# EAGLE design micromouse_v35 (EAGLE 8.0.1)
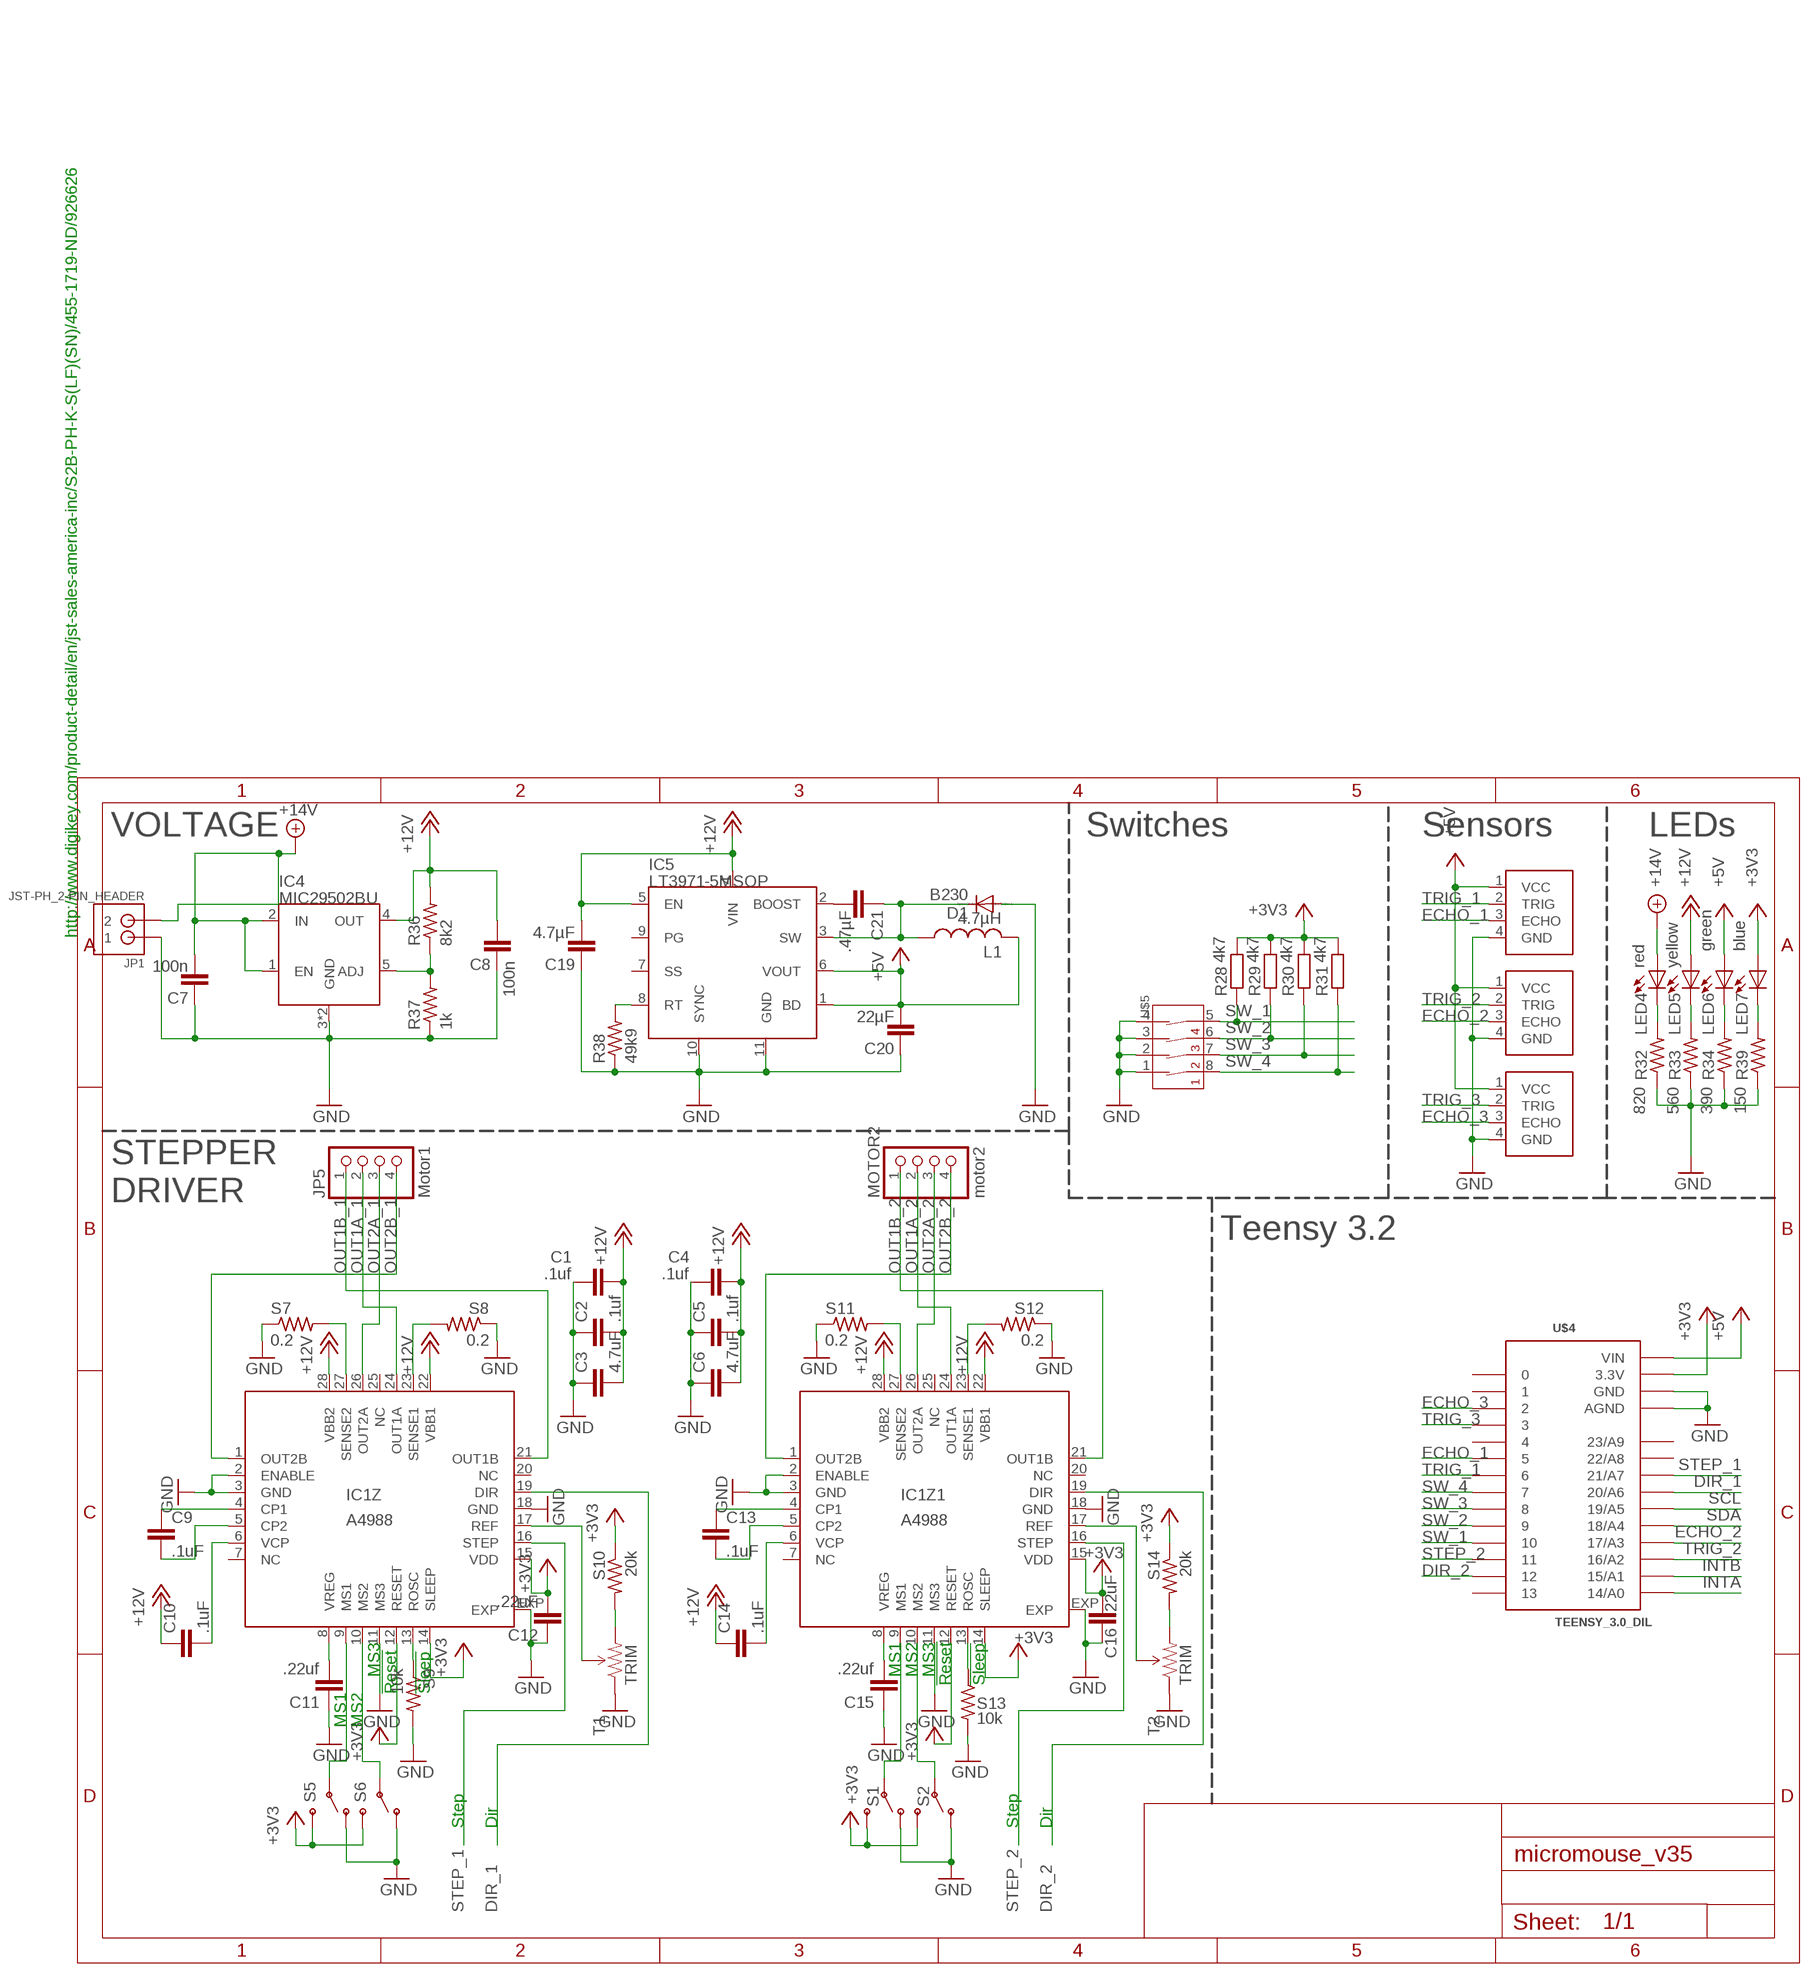
[diagram p0: schematic, sheet 1]

## Parts
C1  .1uf  C-EUC0603  [C0603]
C2  .1uf  C-EUC0603  [C0603]
C3  4.7uF  CAP1206  [1206]
C4  .1uf  C-EUC0603  [C0603]
C5  .1uf  C-EUC0603  [C0603]
C6  4.7uF  CAP1206  [1206]
C7  100n  C-EUC0603  [C0603]
C8  100n  C-EUC0603  [C0603]
C9  .1uF  C-EUC0603  [C0603]
C10  .1uF  C-EUC0603  [C0603]
C11  .22uf  C-EUC0603  [C0603]
C12  .22uF  C-EUC0603  [C0603]
C13  .1uF  C-EUC0603  [C0603]
C14  .1uF  C-EUC0603  [C0603]
C15  .22uf  C-EUC0603  [C0603]
C16  .22uF  C-EUC0603  [C0603]
C19  4.7µF  C-EUC0603  [C0603]
C20  22µF  C-EUC0805  [C0805]
C21  .47µF  C-EUC0603  [C0603]
D1  B230  DIODE-DO-214AC  [DO-214AC]
IC1Z  A4988  A4983  [QFN28ET]
IC1Z1  A4988  A4983  [QFN28ET]
IC4  MIC29502BU  [TO-263-5]
IC5  LT3971-5MSOP  [MSOP-10]
JP1  JST-PH_2-PIN_HEADER  [JST_B2B-PH_HEADER]
JP5  Motor1  PINHD-1X4  [1X04]
L1  4.7µH  L-USL1812  [L1812]
LED4  red  LEDSML0603  [SML0603]
LED5  yellow  LEDSML0603  [SML0603]
LED6  green  LEDSML0603  [SML0603]
LED7  blue  LEDSML0603  [SML0603]
MOTOR2  motor2  PINHD-1X4  [1X04]
R28  4k7  R-EU_R0603  [R0603]
R29  4k7  R-EU_R0603  [R0603]
R30  4k7  R-EU_R0603  [R0603]
R31  4k7  R-EU_R0603  [R0603]
R32  820  R-US_R0603  [R0603]
R33  560  R-US_R0603  [R0603]
R34  390  R-US_R0603  [R0603]
R36  8k2  R-US_R0603  [R0603]
R37  1k  R-US_R0603  [R0603]
R38  49k9  R-US_R0603  [R0603]
R39  150  R-US_R0603  [R0603]
S1  SWITCH-SPDT-SMD-A  [SWITCH-SPST-SMD-A]
S2  SWITCH-SPDT-SMD-A  [SWITCH-SPST-SMD-A]
S5  SWITCH-SPDT-SMD-A  [SWITCH-SPST-SMD-A]
S6  SWITCH-SPDT-SMD-A  [SWITCH-SPST-SMD-A]
S7  0.2  R-US_R0603  [R0603]
S8  0.2  R-US_R0603  [R0603]
S9  10k  R-US_R0603  [R0603]
S10  20k  R-US_R0603  [R0603]
S11  0.2  R-US_R0603  [R0603]
S12  0.2  R-US_R0603  [R0603]
S13  10k  R-US_R0603  [R0603]
S14  20k  R-US_R0603  [R0603]
SENSOR1  HC-SR04SMD  [HC-SR04_SMD]
SENSOR2  HC-SR04SMD  [HC-SR04_SMD]
SENSOR3  HC-SR04SMD  [HC-SR04_SMD]
T1  TRIM  TRIMPOTSMD  [TRIMPOT-3MM]
T2  TRIM  TRIMPOTSMD  [TRIMPOT-3MM]
U$4  TEENSY_3.0_DIL  [TEENSY3-DIL]
U$5  4-POS-DIP  [4-POS-DIP-SMD]

## Nets
+3V3: C12.2 C16.2 IC1Z1.12(RESET) IC1Z1.14(SLEEP) IC1Z1.15(VDD) IC1Z.12(RESET) IC1Z.14(SLEEP) IC1Z.15(VDD) LED7.A R28.2 R29.2 R30.2 R31.2 S1.3(S) S2.3(S) S5.3(S) S6.3(S) S10.1 S14.1 U$4.3.3V
+5V: C20.2 IC5.1(BD) IC5.6(VOUT) L1.2 LED6.A SENSOR1.1(VCC) SENSOR2.1(VCC) SENSOR3.1(VCC) U$4.VIN
+12V: C1.2 C2.2 C3.2 C4.2 C5.2 C6.2 C8.2 C10.1 C14.1 C19.2 IC1Z1.22(VBB1) IC1Z1.28(VBB2) IC1Z.22(VBB1) IC1Z.28(VBB2) IC4.4(OUT) IC5.4(VIN) IC5.5(EN) LED5.A R36.2
+14V: C7.2 IC4.1(EN) IC4.2(IN) JP1.P2 LED4.A
DIR_1: IC1Z.19(DIR) U$4.20/A6
DIR_2: IC1Z1.19(DIR) U$4.12
ECHO_1: SENSOR1.3(ECHO) U$4.5
ECHO_2: SENSOR2.3(ECHO) U$4.17/A3
ECHO_3: SENSOR3.3(ECHO) U$4.2
GND: C1.1 C2.1 C3.1 C4.1 C5.1 C6.1 C7.1 C8.1 C11.1 C12.1 C15.1 C16.1 C19.1 C20.1 D1.A IC1Z1.2(ENABLE) IC1Z1.3(GND) IC1Z1.11(MS3) IC1Z1.18(GND) IC1Z1.EXP IC1Z.2(ENABLE) IC1Z.3(GND) IC1Z.11(MS3) IC1Z.18(GND) IC1Z.EXP IC4.3(GND) IC4.6(GND) IC5.10(SYNC) IC5.11(GND) JP1.P1 R32.1 R33.1 R34.1 R37.1 R38.1 R39.1 S1.1(O) S2.1(O) S5.1(O) S6.1(O) S7.1 S8.1 S9.2 S11.1 S12.1 S13.2 SENSOR1.4(GND) SENSOR2.4(GND) SENSOR3.4(GND) T1.1(CCW) T2.1(CCW) U$4.AGND U$4.GND U$5.1(1A) U$5.2(2A) U$5.3(3A) U$5.4(4A)
INTA: U$4.14/A0
INTB: U$4.15/A1
N$15: LED4.C R32.2
N$16: LED5.C R33.2
N$17: LED6.C R34.2
N$18: IC4.5(ADJ) R36.1 R37.2
N$20: IC5.8(RT) R38.2
N$21: C21.2 IC5.2(BOOST)
N$22: C21.1 D1.C IC5.3(SW) L1.1
N$23: LED7.C R39.2
OUT1A_1: IC1Z.24(OUT1A) JP5.2
OUT1A_2: IC1Z1.24(OUT1A) MOTOR2.2
OUT1B_1: IC1Z.21(OUT1B) JP5.1
OUT1B_2: IC1Z1.21(OUT1B) MOTOR2.1
OUT2A_1: IC1Z.26(OUT2A) JP5.3
OUT2A_2: IC1Z1.26(OUT2A) MOTOR2.3
OUT2B_1: IC1Z.1(OUT2B) JP5.4
OUT2B_2: IC1Z1.1(OUT2B) MOTOR2.4
SCL: U$4.19/A5
SDA: U$4.18/A4
STEP_1: IC1Z.16(STEP) U$4.21/A7
STEP_2: IC1Z1.16(STEP) U$4.11
SW_1: R28.1 U$4.10 U$5.5(4B)
SW_2: R29.1 U$4.9 U$5.6(3B)
SW_3: R30.1 U$4.8 U$5.7(2B)
SW_4: R31.1 U$4.7 U$5.8(1B)
TRIG_1: SENSOR1.2(TRIG) U$4.6
TRIG_2: SENSOR2.2(TRIG) U$4.16/A2
TRIG_3: SENSOR3.2(TRIG) U$4.3
ZCP1: C9.1 IC1Z.4(CP1)
ZCP2: C9.2 IC1Z.5(CP2)
ZCP3: C13.1 IC1Z1.4(CP1)
ZCP4: C13.2 IC1Z1.5(CP2)
ZMS1: IC1Z.9(MS1) S5.2(P)
ZMS2: IC1Z.10(MS2) S6.2(P)
ZMS3: IC1Z1.9(MS1) S1.2(P)
ZMS4: IC1Z1.10(MS2) S2.2(P)
ZREF: IC1Z.17(REF) T1.2(WIPER)
ZREF1: IC1Z1.17(REF) T2.2(WIPER)
ZREF2: S10.2 T1.3(CW)
ZREF3: S14.2 T2.3(CW)
ZROSC: IC1Z.13(ROSC) S9.1
ZROSC1: IC1Z1.13(ROSC) S13.1
ZSENSE1: IC1Z.23(SENSE1) S8.2
ZSENSE2: IC1Z.27(SENSE2) S7.2
ZSENSE3: IC1Z1.27(SENSE2) S11.2
ZSENSE4: IC1Z1.23(SENSE1) S12.2
ZVCP: C10.2 IC1Z.6(VCP)
ZVCP1: C14.2 IC1Z1.6(VCP)
ZVREG: C11.2 IC1Z.8(VREG)
ZVREG1: C15.2 IC1Z1.8(VREG)
Unconnected: IC1Z1.7(NC) IC1Z1.20(NC) IC1Z1.25(NC) IC1Z.7(NC) IC1Z.20(NC) IC1Z.25(NC) IC5.7(SS) IC5.9(PG) U$4.0 U$4.1 U$4.4 U$4.13 U$4.22/A8 U$4.23/A9

## Notes on the sheet
- VOLTAGE | Switches | Sensors | LEDs
- PFD intermediate voltage
- Set for 'mixed-decay' mode.
- http://www.digikey.com/product-detail/en/jst-sales-america-inc/S2B-PH-K-S(LF)(SN)/455-1719-ND/926626 | TP1 = Vref input to driver | TP1 = Vref input to driver
- Monitor this test point with meter | Monitor this test point with meter
- as you adjust current adj pot | as you adjust current adj pot
- Valid range 1.0V to Vcc | Valid range 1.0V to Vcc
- At Vref of 5V max current will be 833mA | At Vref of 5V max current will be 833mA
- At Vref of 2V max current will be 333mA | At Vref of 2V max current will be 333mA
- At Vref of 1V max current will be 166mA | At Vref of 1V max current will be 166mA
- PFD intermediate voltage
- Minimum current gives smoothest microsteps | Minimum current gives smoothest microsteps
- Set for 'mixed-decay' mode.
- Maximum current gives highest torque | Maximum current gives highest torque
- Max Coil Current(in Amps) = Vref(in Volts)/6 | Max Coil Current(in Amps) = Vref(in Volts)/6
- Set R16 to 2.0V at factory = 333mA/phase | Set R16 to 2.0V at factory = 333mA/phase
- DEFAULT OPTIONS | DEFAULT OPTIONS
- Short JP5, JP6, JP7 pins | Short JP5, JP6, JP7 pins
- to GND or Vcc to override | to GND or Vcc to override
- SLEEP = Vcc (awake) | Current adj pot | SLEEP = Vcc (awake) | Current adj pot
- STEPPER
  DRIVER
- MS1 = Vcc (1/8 microstep) | MS1 = Vcc (1/8 microstep)
- MS2 = Vcc (1/8 microstep) | MS2 = Vcc (1/8 microstep)
- ENABLE = GND (enabled) | Teensy 3.2 | ENABLE = GND (enabled)
- RESET = Vcc (not reset) | RESET = Vcc (not reset)
- PFD = Vcc (slow decay mode) | PFD = Vcc (slow decay mode)
- DIR is level sensitive | DIR is level sensitive
- A rising edge on STEP | A rising edge on STEP
- causes a step | causes a step
- Both take 0V to Vcc | Both take 0V to Vcc
- MS3 | MS1 | MS2 | MS3
- !Reset | !Sleep
- !Reset | !Sleep
- MS1 | MS2
- Step | Dir | Step | Dir

## Library data of the parts
C1 C2 C4 C5 C7-C16 C19-C21 = rcl:C-EU: CAPACITOR, European symbol
C3 C6 = SparkFun:CAP: Capacitor Standard 0603 ceramic capacitor, and 0.1" leaded capacitor.
D1 = diode:DIODE-: DIODE
IC1Z IC1Z1 = Allegro:A4983: DMOS Microstepping Driver with Translator Auto generated by make-symbol-device-package-bsdl.ulp Rev. 32 Source: http://www.allegromicro.com/en/Products/Part_Numbers/4983/4983.pdf; MPN: A4983SETTR-T; OC_FARNELL: 1688956; OC_NEWARK: 39M6763
IC4 = own_voltage:MIC29502
IC5 = own_voltage:LT3971-5
JP1 = SRG:JST-PH_2-PIN_HEADER: 2-pin JST PH Shrouded Header, top entry P/N B2B-PH-K-S Mating connector PHR-2 Mating cable assembly: Sparkfun PRT-09914 <http://www.sparkfun.com/products/9914>
JP5 MOTOR2 = pinhead:PINHD-1X4: PIN HEADER
L1 = rcl:L-US: INDUCTOR, American symbol
LED4-LED7 = led:LED: LED OSRAM: - CHIPLED LG R971, LG N971, LY N971, LG Q971, LY Q971, LO R971, LY R971 LH N974, LH R974 LS Q976, LO Q976, LY Q976 LO Q996 - Hyper CHIPLED LW Q18S LB Q993, LB Q99A, LB R99A - SideLED LS A670, LO A670, LY A670, LG A670, LP A670 LB A673, LV A673, LT A673, LW A673 LH A674 LY A675 LS A676, LA A676, LO A676, LY A676, LW A676 LS A679, LY A679, LG A679 - Hyper Micro SIDELED® LS Y876, LA Y876, LO Y876, LY Y876 LT Y87S - SmartLED LW L88C, LW L88S LB L89C, LB L89S, LG L890 LS L89K, LO L89K, LY L89K LS L896, LA L896, LO L896, LY L896 - TOPLED LS T670, LO T670, LY T670, LG T670, LP T670 LSG T670, LSP T670, LSY T670, LOP T670, LYG T670 LG T671, LOG T671, LSG T671 LB T673, LV T673, LT T673, LW T673 LH T674 LS T676, LA T676, LO T676, LY T676, LB T676, LH T676, LSB T676, LW T676 LB T67C, LV T67C, LT T67C, LS T67K, LO T67K, LY T67K, LW E67C LS E67B, LA E67B, LO E67B, LY E67B, LB E67C, LV E67C, LT E67C LW T67C LS T679, LY T679, LG T679 LS T770, LO T770, LY T770, LG T770, LP T770 LB T773, LV T773, LT T773, LW T773 LH T774 LS E675, LA E675, LY E675, LS T675 LS T776, LA T776, LO T776, LY T776, LB T776 LHGB T686 LT T68C, LB T68C - Hyper Mini TOPLED® LB M676 - Mini TOPLED Santana® LG M470 LS M47K, LO M47K, LY M47K Source: http://www.osram.convergy.de LUXEON: - LUMILED® LXK2-PW12-R00, LXK2-PW12-S00, LXK2-PW14-U00, LXK2-PW14-V00 LXK2-PM12-R00, LXK2-PM12-S00, LXK2-PM14-U00 LXK2-PE12-Q00, LXK2-PE12-R00, LXK2-PE12-S00, LXK2-PE14-T00, LXK2-PE14-U00 LXK2-PB12-K00, LXK2-PB12-L00, LXK2-PB12-M00, LXK2-PB14-N00, LXK2-PB14-P00, LXK2-PB14-Q00 LXK2-PR12-L00, LXK2-PR12-M00, LXK2-PR14-Q00, LXK2-PR14-R00 LXK2-PD12-Q00, LXK2-PD12-R00, LXK2-PD12-S00 LXK2-PH12-R00, LXK2-PH12-S00 LXK2-PL12-P00, LXK2-PL12-Q00, LXK2-PL12-R00 Source: www.luxeon.com KINGBRIGHT: KA-3528ASYC Source: www.kingbright.com
R28-R31 = rcl:R-EU_: RESISTOR, European symbol
R32-R34 R36-R39 S7-S14 = rcl:R-US_: RESISTOR, American symbol
S1 S2 S5 S6 = SparkFun-Electromechanical:SWITCH-SPDT: SPDT Switch Simple slide switch, Spark Fun Electronics SKU : COM-00102 DPDT SMT slide switch, AYZ0202, SWCH-08179; PROD_ID: SWCH-10651
SENSOR1-SENSOR3 = own_voltage:HC-SR04
T1 T2 = SparkFun:TRIMPOT
U$4 = Teensy_3_and_LC_Series_Boards_v1.1:TEENSY_3.0_DIL: TEENSY 3.0 in a classic breadboard layout - pins between the two outer rows.
U$5 = SparkFun-Electromechanical:4-POS-DIP: 4 Position DIP Switch CTS series 219; PROD_ID: SWCH-12418

## Board
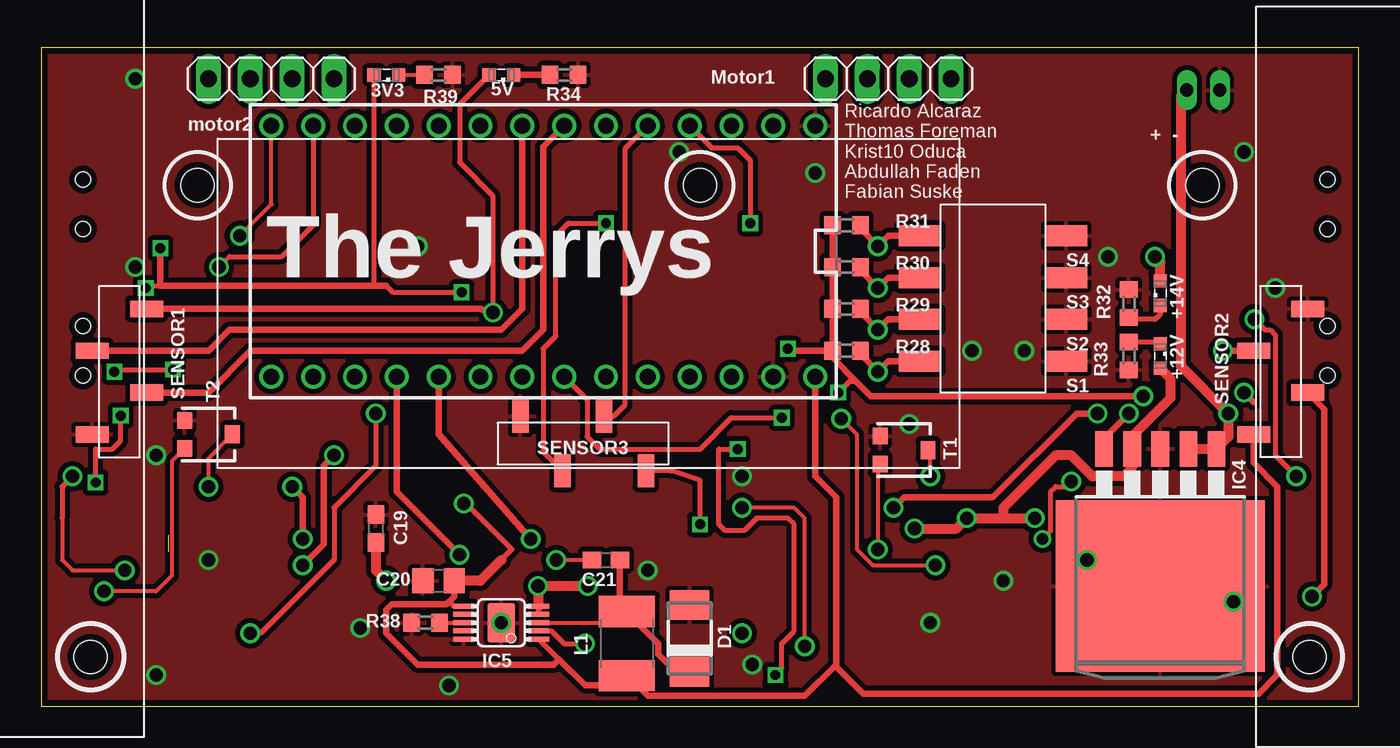
[diagram p1: board, top side]
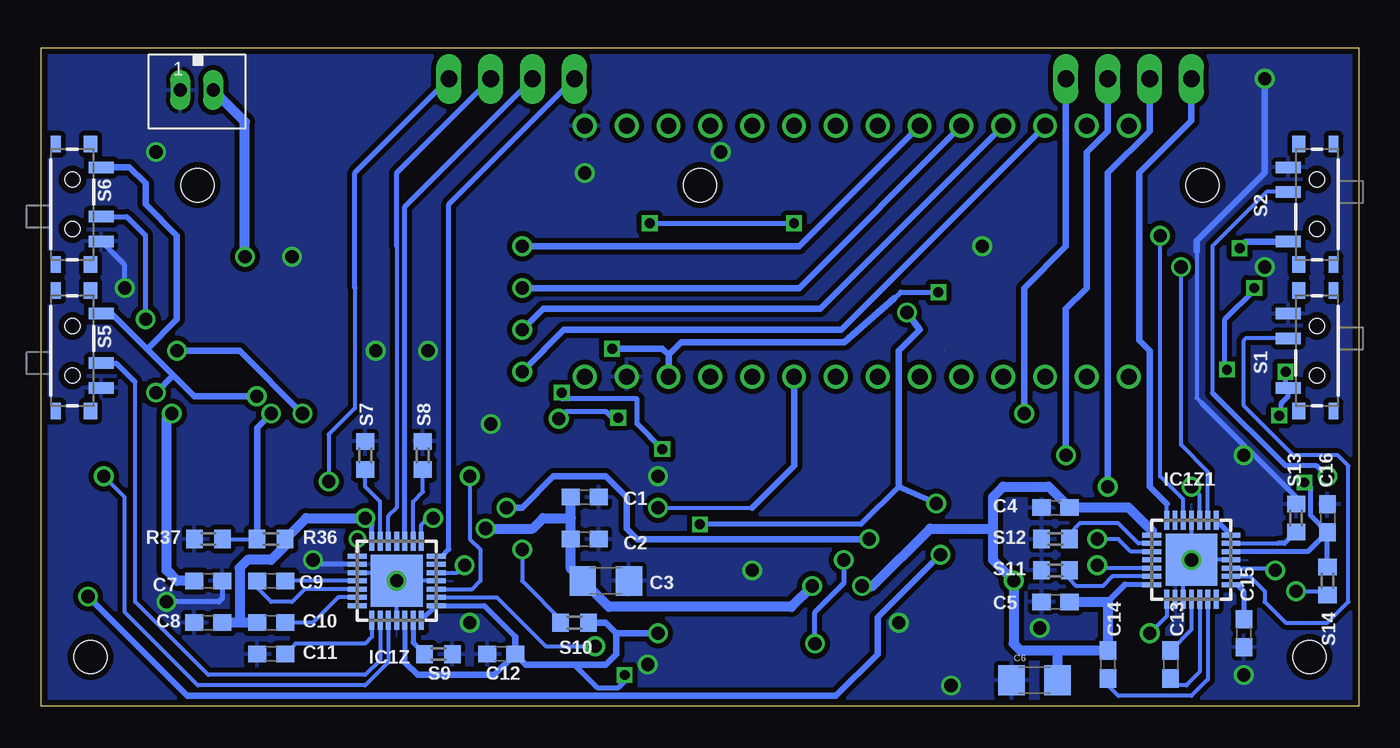
[diagram p2: board, bottom side, seen from below]

Size 80 x 40 mm. Coordinates in mm from the lower left corner, seen from the top.
Outline: 0,0 80,0 80,40 0,40 0,0
Copper layers (1*16): Top 0.0356mm / dielectric 1.5011mm / Bottom 0.0356mm
Design rules "oshpark-2layer *": minimum track width 6mil, minimum drill 13mil, track to track 6mil, track to pad 6mil, pad to pad 6mil, via to via 6mil, smd to smd 6mil, copper to edge 15mil, drill to drill 6mil, minimum pad ring 7mil, minimum via ring 7mil, stop-mask expansion 2.5mil, vias tented up to drill 50mil, thermal gap 10mil
Holes 2 mm at 3,3 77,3 9.5,31.64 40,31.64 70.5,31.64

### Footprints (pad centres in the part's own frame; a part is rotated, then mirrored left to right if it is on the bottom)
C0603 = smd 1.1 x 1: 1 -0.85,0; 2 0.85,0
1206 = smd 1.6 x 1.8: 1 -1.4,0; 2 1.4,0
C0805 = smd 1.3 x 1.5: 1 -0.95,0; 2 0.95,0
DO-214AC = smd 1.8 x 2.4: A 2.025,0; C -2.025,0
QFN28ET = smd 1.15 x 0.3: 1 -2.4,1.5; 2 -2.4,1; 3 -2.4,0.5; 4 -2.4,0; 5 -2.4,-0.5; 6 -2.4,-1; 7 -2.4,-1.5; 15 2.4,-1.5; 16 2.4,-1; 17 2.4,-0.5; 18 2.4,0; 19 2.4,0.5; 20 2.4,1; 21 2.4,1.5 | smd 0.3 x 1.15: 8 -1.5,-2.4; 9 -1,-2.4; 10 -0.5,-2.4; 11 0,-2.4; 12 0.5,-2.4; 13 1,-2.4; 14 1.5,-2.4; 22 1.5,2.4; 23 1,2.4; 24 0.5,2.4; 25 0,2.4; 26 -0.5,2.4; 27 -1,2.4; 28 -1.5,2.4 | smd 3.15 x 3.15: EXP 0,0
TO-263-5 = smd 1.067 x 2.159: 1 -3.404,-8.331; 2 -1.702,-8.331; 3 0,-8.331; 4 1.702,-8.331; 5 3.404,-8.331 | smd 12.7 x 10.41: 6 0,0
MSOP-10 = smd 0.305 x 1.27: 1 -1,-2.273; 2 -0.5,-2.273; 3 0,-2.273; 4 0.5,-2.273; 5 1,-2.273; 6 1,2.273; 7 0.5,2.273; 8 0,2.273; 9 -0.5,2.273; 10 -1,2.273 | smd 2.38 x 1.65: 11 0,0
JST_B2B-PH_HEADER = drill 0.8 long: P1 1.075,0.048; P2 -0.925,0.048
1X04 = drill 1.016 long: 1 -3.81,0; 2 -1.27,0; 3 1.27,0; 4 3.81,0
L1812 = smd 1.9 x 3.4: 1 -1.95,0; 2 1.95,0
SML0603 = smd 0.8 x 0.8: A 0.75,0; C -0.75,0
R0603 = smd 1 x 1.1: 1 -0.85,0; 2 0.85,0
SWITCH-SPST-SMD-A = smd 0.7 x 1.5: 1 -2.25,-1.75; 2 -0.75,-1.75; 3 2.25,-1.75 | smd 1 x 0.6: GND1 -3.65,1; GND3 3.65,1 | smd 1 x 0.8: GND2 -3.65,-1.1; GND4 3.65,-1.1 | hole 0.9: -1.5,0; 1.5,0
HC-SR04_SMD = smd 1 x 2: 1 3.81,-9.207; 2 1.27,-5.907; 3 -1.27,-9.207; 4 -3.81,-5.907
TRIMPOT-3MM = smd 1 x 0.9: 1 -0.85,-1.45; 3 0.85,-1.45 | smd 1.1 x 0.9: 2 0,1.45
TEENSY3-DIL = drill 0.965: 0 -7.62,13.97; 1 -7.62,11.43; 2 -7.62,8.89; 3 -7.62,6.35; 3.3V 7.62,11.43; 4 -7.62,3.81; 5 -7.62,1.27; 6 -7.62,-1.27; 7 -7.62,-3.81; 8 -7.62,-6.35; 9 -7.62,-8.89; 10 -7.62,-11.43; 11 -7.62,-13.97; 12 -7.62,-16.51; 13 7.62,-16.51; 14/A0 7.62,-13.97; 15/A1 7.62,-11.43; 16/A2 7.62,-8.89; 17/A3 7.62,-6.35; 18/A4 7.62,-3.81; 19/A5 7.62,-1.27; 20/A6 7.62,1.27; 21/A7 7.62,3.81; 22/A8 7.62,6.35; 23/A9 7.62,8.89; AGND 7.62,13.97; GND -7.62,16.51; VIN 7.62,16.51
4-POS-DIP-SMD = smd 1.27 x 2.54: 1 -3.81,4.445; 2 -1.27,4.445; 3 1.27,4.445; 4 3.81,4.445; 5 3.81,-4.445; 6 1.27,-4.445; 7 -1.27,-4.445; 8 -3.81,-4.445

### Placement (x,y rotation side)
C1  46.99,12.7 180 bottom
C2  46.99,10.16 180 bottom
C3  45.72,7.62 180 bottom
C4  18.41,12.06 0 bottom
C5  18.41,6.35 0 bottom
C6  19.68,1.59 0 bottom
C7  69.85,7.62 180 bottom
C8  69.85,5.08 0 bottom
C9  66.04,7.62 180 bottom
C10  66.04,5.08 0 bottom
C11  66.04,3.17 0 bottom
C12  52.07,3.17 0 bottom
C13  11.43,2.54 270 bottom
C14  15.24,2.54 270 bottom
C15  6.99,4.45 90 bottom
C16  1.91,11.43 270 bottom
C19  20.32,10.79 270 top
C20  24.13,7.62 0 top
C21  34.29,8.89 180 top
D1  39.37,4.13 90 top
IC1Z  58.42,7.62 0 bottom
IC1Z1  10.16,8.89 90 bottom
IC4  67.94,7.3 180 top
IC5  27.94,5.08 90 top
JP1  70.48,37.47 180 bottom
JP5  51.44,38.1 0 top
L1  35.56,3.81 270 top
LED4  67.94,25.08 90 top
LED5  67.94,21.27 270 top
LED6  27.94,38.34 180 top
LED7  20.95,38.34 180 top
MOTOR2  13.97,38.1 0 top
R28  48.9,21.59 180 top
R29  48.9,24.13 180 top
R30  48.9,26.67 180 top
R31  48.9,29.21 180 top
R32  66.04,24.45 270 top
R33  66.04,21.27 90 top
R34  31.75,38.34 180 top
R36  66.04,10.16 0 bottom
R37  69.85,10.16 0 bottom
R38  23.34,5.08 0 top
R39  24.13,38.34 180 top
S1  2.54,21.59 270 bottom
S2  2.54,30.48 270 bottom
S5  78.11,21.59 90 bottom
S6  78.11,30.48 90 bottom
S7  60.33,15.24 270 bottom
S8  56.83,15.24 270 bottom
S9  55.88,3.17 0 bottom
S10  47.62,5.08 180 bottom
S11  18.41,8.26 0 bottom
S12  18.41,10.16 0 bottom
S13  3.81,11.43 90 bottom
S14  1.91,7.62 270 bottom
SENSOR1  -2.81,20.32 90 top
SENSOR2  82.82,20.32 270 top
SENSOR3  32.91,23.51 0 top
T1  52.39,15.56 270 top
T2  10.16,16.51 270 top
U$4  30.48,27.62 270 top
U$5  57.78,24.77 270 top

### Tracks (layer width: path | path; a pad name or v marks a point on that pad's centre or on a via)
+3V3  (via drill 0.6, 0.8)  (1 unrouted)
  Top 0.305: v44.58,1.91 44.96,2.29 44.96,3.81 45.72,4.57 45.72,11.05 45.34,11.43 43.43,11.43 42.67,10.67 41.53,10.67 41.15,11.05 41.15,15.62 v42.29,15.62 | v48.39,19.05 49.09,19.75 49.47,19.75 | v3.3,13.59 3.3,15.62 4.32,15.62 4.83,16.13 v4.83,17.65 | v4.45,20.32 4.57,20.45 v8,20.45 | v6.35,25.4 6.48,25.53 7.24,25.53 | LED7.A 20.19,38.33 20.19,25.53 | 20.95,25.53 21.34,25.15 v25.53,25.15
  Top 0.406: R28.2 R29.2 R30.2 R31.2 | v66.91,18.84 50.38,18.84 49.47,19.75 48.05,21.17 R28.2 | 73.61,18.46 v73.03,19.05 | v7.24,27.81 7.24,25.53 20.19,25.53 20.95,25.53 | v45.34,21.72 45.47,21.59 R28.2
  Bottom 0.305: IC1Z.12 57.92,2.67 | IC1Z.14 IC1Z.15 53.11,6.12 51.22,4.23 | IC1Z1.14 IC1Z1.15 | S14.1 C16.2 | 47.62,2.54 46.23,1.14 44.96,1.14 44.58,1.52 v44.58,1.91 | v42.29,15.62 43.81,17.14 43.81,18.67 48.39,18.67 v48.39,19.05 | C16.2 3.1,9.39 IC1Z1.12 | C16.2 2.92,11.6 2.92,13.34 3.17,13.59 v3.3,13.59 | v4.83,17.65 4.7,17.78 4.7,18.41 4.29,18.82 S1.3 4.45,19.5 v4.45,20.32 | v8,20.45 8.13,20.57 8.13,23.5 6.35,25.27 v6.35,25.4 | 28.19,24.77 27.81,25.15 v25.53,25.15
  Bottom 0.406: 71.98,20.1 73.56,21.68 | v73.03,19.05 71.98,20.1 | 71.98,20.1 70.72,18.84 v66.91,18.84 | C12.2 50.59,2.54 47.62,2.54 45.72,2.54 45.09,3.17 45.09,4.45 | C12.2 51.22,4.23 | 57.92,2.67 57.15,1.91 52.49,1.91 C12.2 | 73.56,21.68 71.75,23.5 71.75,28.57 73.66,30.48 73.66,31.75 74.64,32.73 S6.3 | 45.09,4.45 45.72,5.08 S10.1 | v42.55,4.45 45.09,4.45 | S5.3 75.72,23.84 73.56,21.68 | S2.3 4.33,28.19 6.86,28.19 v7.24,27.81 | 28.19,24.77 31.24,22.1 41.15,22.1 41.91,21.34 | 41.91,21.34 U$4.3.3V | 41.91,21.34 42.29,21.72 v45.34,21.72
+5V  (via drill 0.6, 0.8)
  Top 0.254: 35.56,1.27 L1.2 35.6,1.86
  Top 0.305: IC5.1 31.43,2.86 | LED6.A 25.4,36.55 25.4,33.02 27.43,30.99 v27.43,23.91 | IC5.6 25.04,6.08 24.77,6.35 | v40.01,11.05 40.01,13.72 38.27,14.3 SENSOR3.1 | 27.94,8.89 28.57,9.53 25.78,12.32 v25.65,12.32
  Top 0.406: 35.56,1.27 33.02,1.27 31.43,2.86 31.11,2.54 22.86,2.54 20.95,4.45 20.95,5.87 21.27,6.19 24.61,6.19 24.77,6.35 25.08,6.67 C20.2 | 35.6,1.86 36.83,0.64 46.35,0.64 48.2,2.48 | 48.2,2.48 48.26,2.54 48.26,12.7 46.99,13.97 U$4.VIN | SENSOR1.1 26.67,24.13 v27.43,23.91 | 48.2,2.48 49.91,0.76 73.91,0.76 75.06,1.91 75.06,13.34 73.61,14.78 SENSOR2.1
  Top 0.61: 27.94,8.89 26.67,7.62 C20.2
  Bottom 0.305: 27.94,13.34 30.23,11.05 v40.01,11.05
  Bottom 0.406: v27.43,23.91 26.67,22.86 27.94,21.59 27.94,13.34 v25.65,12.32
+12V  (via drill 0.8)
  Top 0.305: IC5.4 IC5.5
  Top 0.61: 58.42,11.43 v56.2,11.43 55.56,10.79 v53.02,10.79 | 58.42,11.43 v60.33,11.43 | 58.42,11.43 58.42,12.06 61.59,15.24 62.55,15.24 63.82,13.97 65.72,13.97 66.24,14.49 IC4.4 66.24,16.4 68.58,18.73 68.58,19.89 LED5.A | C19.2 20.32,8.26 v20.95,7.62 | v33.18,7.3 v30.16,7.3 30.21,7.25 IC5.5
  Bottom 0.254: 47.12,7.75 C3.2 47.84,8.34 | v56.2,11.43 56.52,11.43 56.92,11.03 IC1Z.22 | IC1Z1.22 12.56,10.65 | R36.2 65.19,9.74
  Bottom 0.305: IC1Z1.28 14.2,7.39 | IC1Z.28 59.92,11.03 v60.33,11.43 62.23,11.43
  Bottom 0.406: 14.2,7.39 15.24,6.35
  Bottom 0.61: 47.84,11.43 C2.2 47.84,8.34 | 47.84,11.43 C1.2 | C5.2 15.24,6.35 C14.1 18.41,3.39 | 18.41,3.39 20.54,3.39 20.95,3.81 v20.95,7.62 22.23,8.89 22.23,10.79 | 12.56,10.65 13.97,12.06 C4.2 18.84,13.34 21.59,13.34 22.23,12.7 22.23,10.79 | v33.18,7.3 34.45,6.03 45.53,6.03 C3.2 | C10.1 67.94,5.08 | 67.94,5.08 C8.2 | R36.2 63.92,11.43 v60.33,11.43 | 65.19,9.74 66.04,8.89 67.47,8.89 67.94,8.41 67.94,5.08 | 22.23,10.79 26.04,10.79 29.53,7.3 v30.16,7.3 | v53.02,10.79 50.16,10.79 49.53,11.43 47.84,11.43 | C6.2 18.29,3.26 18.41,3.39
+14V  (via drill 0.8)
  Top 0.254: LED4.A 67.94,25.72
  Top 0.61: LED4.A 67.94,26.99 v67.63,27.3 | IC4.2 IC4.1 72.07,16.36 v72.07,17.78 69.22,20.64 69.22,37.07 JP1.P2
  Bottom 0.61: v67.63,27.3 67.63,35.48 JP1.P2 | C7.2 71.75,7.62 72.39,8.26 72.39,17.46 v72.07,17.78
DIR_1  (via drill 0.6, 0.8)
  Top 0.254: v48.58,17.46 49.53,16.51 49.53,9.53 50.48,8.57 v54.29,8.57
  Top 0.305: v44.96,17.53 41.91,17.53 40.01,15.62 33.91,15.62 33.15,16.38 33.15,18.61 U$4.20/A6
  Bottom 0.254: IC1Z.19 54.74,8.12 v54.29,8.57
  Bottom 0.305: v48.58,17.46 48.13,17.91 45.72,17.91 45.34,17.53 v44.96,17.53
DIR_2  (via drill 0.8)
  Top 0.254: v12.06,28.57 13.97,30.48 U$4.12
  Bottom 0.254: IC1Z1.19 10.66,12.56 12.06,13.97 v12.06,28.57
ECHO_1  (1 unrouted)
  Top 0.406: SENSOR1.3 10.16,19.05 12.7,21.59 29.21,21.59 30.48,22.86 30.48,33.97 U$4.5
ECHO_2  (via drill 0.8)
  Top 0.406: v71.75,21.59 SENSOR2.3 | v51.75,12.06 52.39,12.7 57.78,12.7 62.87,17.78 v64.14,17.78 | v29.72,10.16 24.13,16.51 U$4.17/A3
  Bottom 0.406: v51.75,12.06 50.8,12.06 48.9,13.97 45.72,13.97 44.45,12.7 44.45,10.79 43.81,10.16 v29.72,10.16 | v64.14,17.78 67.94,21.59 v71.75,21.59
ECHO_3  (via drill 0.6)
  Top 0.305: 31.62,14.67 SENSOR3.3 30.48,15.46 30.48,21.72 31.24,22.48 31.24,28.57 32,29.34 v34.29,29.34 | U$4.2 40.7,33.91 42.29,33.91 43.05,33.15 v43.05,29.34
  Bottom 0.305: v43.05,29.34 v34.29,29.34
GND  (via drill 0.8)
  Top 0.305: v72.39,6.35 68.9,6.35 IC4.6
  Bottom 0.254: IC1Z1.3 10.66,8.39 IC1Z1.EXP | IC1Z1.18 IC1Z1.EXP | IC1Z1.11 IC1Z1.EXP | IC1Z.11 IC1Z.EXP | IC1Z.3 58.92,8.12 IC1Z.EXP | IC1Z.18 IC1Z.EXP | 9.84,27.62 9.84,18.73 9.53,18.41
  Bottom 0.305: v74.93,25.4 74.93,26.8 S6.1 | IC1Z.2 63.23,8.62 v63.5,8.89 | C7.1 69,6.57 69.22,6.35 v72.39,6.35 | S13.2 3.81,12.7 9.53,18.41
  Bottom 0.406: 9.84,27.62 9.84,28.26 5.71,32.38 v5.71,38.1
  other vias: 58.42,7.62 10.16,8.89 24.77,1.27 53.98,5.08 43.18,2.54 27.94,5.08 19.37,4.76 6.99,1.91 5.71,26.67 52.7,17.14 56.52,21.59 59.69,21.59 64.77,27.3 36.83,8.26 22.86,27.94 38.73,33.66 46.99,32.38 73.03,33.66 6.99,15.24 42.55,13.97
  pour Top (isolate 0.305, rank 6): 0,40.56 80.64,40.56 80.64,0 0,0
  pour Bottom (isolate 0.305, rank 6): 0,40.56 80.64,40.56 80.64,0 0,0
N$15
  Top 0.305: LED4.C 67.94,23.81 67.63,23.5 66.14,23.5 R32.2
N$16
  Top 0.305: R33.2 67.84,22.12 LED5.C
N$17
  Top 0.406: LED6.C R34.2
N$18  (via drill 0.8)
  Top 0.406: IC4.5 64.54,16.28 v66.04,17.78
  Bottom 0.254: R37.2 R36.1
  Bottom 0.406: v66.04,17.78 66.89,16.93 R36.1
N$20
  Top 0.254: R38.2 IC5.8
N$21  (via drill 0.8)
  Top 0.254: IC5.2 30.98,4.58 | v31.27,8.89 C21.2
  Top 0.305: 30.98,4.58 31.75,3.81 v33.02,3.81
  Bottom 0.305: v33.02,3.81 33.02,5.71 31.27,7.46 v31.27,8.89
N$22
  Top 0.254: 35.39,5.93 L1.1 | IC5.3 35.57,5.08 35.9,5.41 35.9,5.42 L1.1 | L1.1 35.56,5.59
  Top 0.406: C21.1 35.14,6.18 L1.1 | 35.56,5.59 35.68,5.59 37.47,3.81 37.47,3.17 38.73,1.91 39.17,1.91 D1.C
N$23
  Top 0.254: LED7.C R39.2
OUT1A_1
  Bottom 0.305: IC1Z.24 57.92,30.34 JP5.2
OUT1A_2  (via drill 0.8)
  Top 0.406: v15.24,13.34 15.88,12.7 v15.88,10.16
  Bottom 0.254: IC1Z1.24 13.84,9.39 14.61,10.16 v15.88,10.16
  Bottom 0.406: MOTOR2.2 12.7,34.92 15.24,32.38 v15.24,13.34
OUT1B_1
  Bottom 0.305: IC1Z.21 55.65,9.12 55.24,9.53 55.24,30.48 JP5.1
OUT1B_2
  Bottom 0.254: IC1Z1.21 11.66,12.29
  Bottom 0.406: MOTOR2.1 10.16,35.56 13.34,32.38 13.34,22.23 12.7,21.59 12.7,13.34 11.66,12.29
OUT2A_1
  Bottom 0.254: 58.42,27.94 58.42,12.06 58.92,11.56 IC1Z.26
  Bottom 0.305: 58.42,27.94 58.42,32.38 JP5.3
OUT2A_2  (via drill 0.8)
  Top 0.406: v17.78,15.24 17.14,14.61 17.14,9.84 v15.88,8.57
  Bottom 0.254: IC1Z1.26 15.69,8.39 v15.88,8.57
  Bottom 0.406: MOTOR2.3 15.24,34.92 16.51,33.66 16.51,25.4 17.78,24.13 v17.78,15.24
OUT2B_1  (via drill 0.7, 0.8)
  Top 0.305: v62.55,13.65 62.23,13.34 61.59,13.34 61.28,13.02 61.28,10.64 v60.8,10.16
  Bottom 0.254: 60.96,25.4 60.96,18.1 62.55,16.51 v62.55,13.65
  Bottom 0.305: v60.8,10.16 60.8,9.14 IC1Z.1 | 60.96,25.4 60.96,32.38 JP5.4
OUT2B_2  (via drill 0.8)
  Top 0.254: v12.7,4.45 13.34,4.45
  Top 0.305: v20.32,17.78 20.32,14.61 17.78,12.06 17.78,8.89 13.34,4.45
  Bottom 0.254: IC1Z1.1 11.66,5.49 v12.7,4.45
  Bottom 0.406: v20.32,17.78 20.32,25.4 17.78,27.94 MOTOR2.4
STEP_1  (via drill 0.8)
  Top 0.254: v46.35,3.65 46.35,11.43 45.72,12.06 v42.55,12.06
  Bottom 0.254: IC1Z.16 52.34,6.62 49.37,3.65 v46.35,3.65 | v42.55,12.06 36.83,12.06
  Bottom 0.406: 36.83,12.06 34.29,14.61 U$4.21/A7
STEP_2  (via drill 0.8)
  Top 0.254: v10.79,26.67 11.43,27.3
  Top 0.305: 11.43,27.3 14.61,27.3 16.51,29.21 U$4.11
  Bottom 0.254: IC1Z1.16 9.16,14.24 10.79,15.88 v10.79,26.67
SW_1  (via drill 0.8)
  Top 0.406: R28.1 49.74,21.38 v50.8,20.32 51.44,20.95 U$5.5
  Bottom 0.406: 49.53,21.59 v50.8,20.32 48.26,22.86 31.43,22.86 U$4.10
SW_2  (via drill 0.8)
  Top 0.406: R29.1 49.74,23.91 v50.8,22.86 51.44,23.5 U$5.6
  Bottom 0.406: U$4.9 32.7,24.13 49.53,24.13 v50.8,22.86
SW_3  (via drill 0.8)
  Top 0.406: R30.1 49.74,26.45 v50.8,25.4 51.44,26.04 U$5.7
  Bottom 0.406: U$4.8 33.97,25.4 v50.8,25.4
SW_4  (via drill 0.8)
  Top 0.406: R31.1 49.74,29 v50.8,27.94 51.44,28.57 U$5.8
  Bottom 0.406: v50.8,27.94 33.97,27.94 U$4.7
TRIG_1
  Top 0.406: SENSOR1.2 10.16,21.59 11.43,22.86 27.94,22.86 29.21,24.13 U$4.6
TRIG_2  (via drill 0.8)
  Top 0.406: v77.15,6.67 77.91,7.43 77.91,18.05 SENSOR2.2 | v25.4,9.21 21.59,13.02 U$4.16/A2
  Bottom 0.406: v77.15,6.67 71.12,0.64 31.75,0.64 29.21,3.17 29.21,5.4 v25.4,9.21
TRIG_3
  Top 0.305: SENSOR3.2 34.75,17.6 35.43,18.29 35.43,33.85 U$4.3
ZCP1
  Bottom 0.254: IC1Z.4 C9.1
ZCP2
  Bottom 0.254: IC1Z.5 64,7.12 64.77,6.35 66.04,6.35 66.89,7.2 C9.2
ZCP3
  Bottom 0.254: IC1Z1.4 10.16,4.66 C13.1
ZCP4
  Bottom 0.254: IC1Z1.5 9.66,2.09 10.48,1.27 11.01,1.27 C13.2
ZMS1
  Bottom 0.254: IC1Z.9 59.42,2.81 60.33,1.91 69.85,1.91 74.3,6.35 74.3,19.68
  Bottom 0.305: S5.2 75.45,20.84 74.3,19.68
ZMS2  (via drill 0.8)
  Top 0.305: v73.66,23.5 74.3,22.86 74.61,22.86 74.93,22.54 74.93,15.24 v76.2,13.97
  Bottom 0.254: IC1Z.10 58.92,2.67 60.33,1.27 70.48,1.27 74.93,5.71 74.93,12.7 v76.2,13.97
  Bottom 0.305: S6.2 74.81,29.73 73.66,28.57 v73.66,23.5
ZMS3
  Bottom 0.254: S1.2 6.87,22.34 6.99,22.23 6.99,18.26 3.97,15.24 1.27,15.24 0.64,14.61 0.64,6.35 1.91,5.08 4.45,5.08 5.71,6.35 5.71,6.99 6.62,7.89 IC1Z1.9
ZMS4  (via drill 0.8)
  Top 0.254: 1.27,11.43 1.27,8.89 1.91,8.26 v5.08,8.26
  Top 0.305: v1.91,13.97 1.27,13.34 1.27,11.43
  Bottom 0.254: S2.2 5.6,31.23 8.89,27.94 8.89,19.05 | IC1Z1.10 5.21,8.39 v5.08,8.26
  Bottom 0.305: v1.91,13.97 2.54,14.61 4.45,14.61 8.89,19.05
ZREF  (via drill 0.8)
  Top 0.254: v53.98,13.97 53.98,15.42 T1.2
  Bottom 0.254: IC1Z.17 53.84,7.12 53.34,7.62 53.34,9.53 53.98,10.16 v53.98,13.97
ZREF1  (via drill 0.8)
  Top 0.254: v10.16,13.34 10.16,15.06 T2.2
  Bottom 0.254: IC1Z1.17 9.66,12.84 v10.16,13.34
ZREF2  (via drill 0.8)
  Top 0.254: T1.3 50.8,14.57 v50.8,9.53
  Bottom 0.254: S10.2 48.26,5.08 50.8,7.62 v50.8,9.53
ZREF3  (via drill 0.8)
  Top 0.254: v3.81,6.99 6.99,6.99 7.94,7.94 7.94,14.89 T2.3
  Bottom 0.254: v3.81,6.99 2.12,6.99 S14.2
ZROSC
  Bottom 0.305: IC1Z.13 57.42,3.87 S9.1
ZROSC1
  Bottom 0.254: IC1Z1.13 4.93,9.89
  Bottom 0.305: S13.1 4.5,9.89 4.93,9.89
ZSENSE1
  Bottom 0.254: IC1Z.23 57.42,12.43 56.83,13.02 S8.2
ZSENSE2
  Bottom 0.254: IC1Z.27 59.42,12.43 60.33,13.34 S7.2
ZSENSE3
  Bottom 0.254: IC1Z1.27 14.97,7.89 15.56,7.3 17.14,7.3 17.57,7.72 S11.2
ZSENSE4
  Bottom 0.254: IC1Z1.23 13.38,9.89 14.61,11.11 16.93,11.11 17.57,10.48 S12.2
ZVCP
  Bottom 0.254: IC1Z.6 61.96,6.62 63.5,5.08 C10.2
ZVCP1
  Bottom 0.254: C14.2 15.24,1.27 14.61,0.64 10.16,0.64 9.16,1.64 IC1Z1.6
ZVREG
  Bottom 0.254: IC1Z.8 59.92,4.21 60.33,3.81 64.56,3.81 C11.2
ZVREG1
  Bottom 0.305: IC1Z1.8 7.39,7.39 6.99,6.99 C15.2

### Text on the board
tPlace: Motor1 | 3V3 | 5V | motor2 | + - | Ricardo Alcaraz / Thomas Foreman / Krist10 Oduca / Abdullah Faden / Fabian Suske | S4 | The Jerrys | S3 | +14V | S2 | +12V | S1